# EasyEDA schematic 1-Schematic_TimerAndTemper.json
TITLE: Timer; REV: 1.0; Date: 2021-10-04; Sheet: 1/1; Drawn By: fangxx3863; Company: Myself
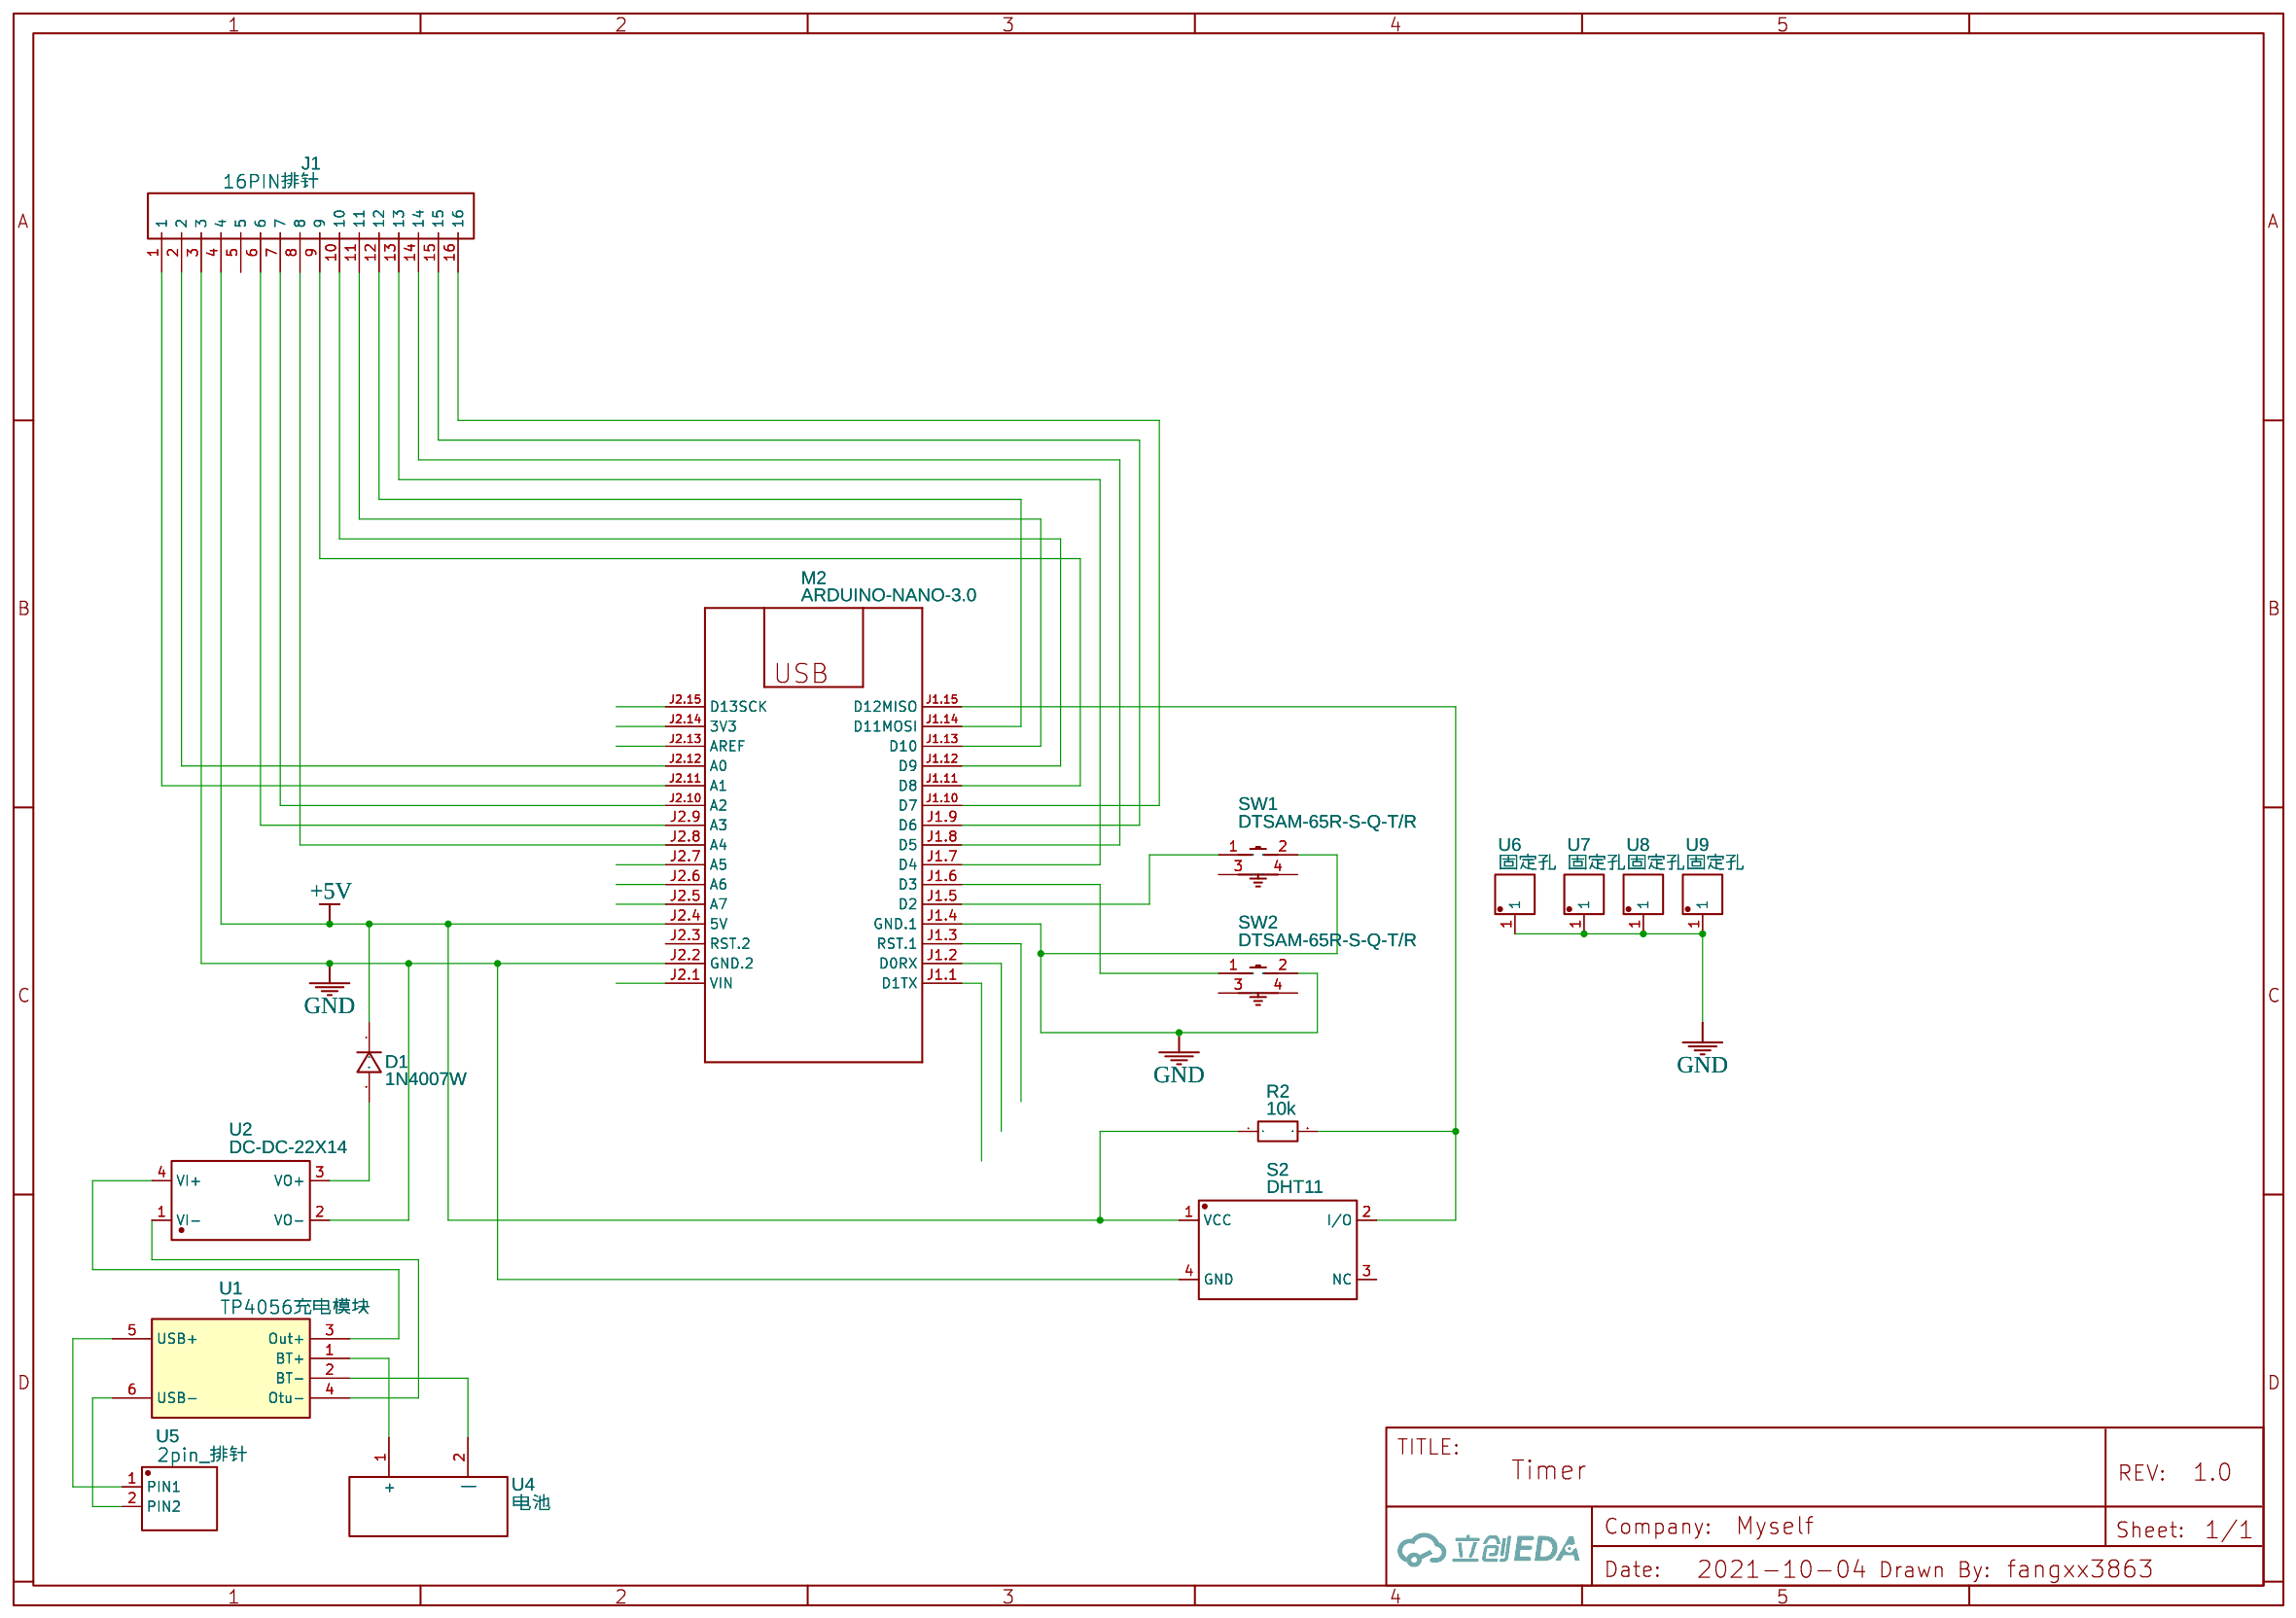
[diagram p0: schematic sheet]

## Parts
D1  1N4007W  [SOD-123_L2.8-W1.8-LS3.7-RD]
J1  16PIN排针  [16PIN排针]
M2  ARDUINO-NANO-3.0  [ARDUINO-NANO-3.0]
R2  10k  [R0603]
S2  DHT11  [DHT11]
SW1  DTSAM-65R-S-Q-T/R  [SW-SMD_DTSAM-65R-S-Q-T-R]
SW2  DTSAM-65R-S-Q-T/R  [SW-SMD_DTSAM-65R-S-Q-T-R]
U1  TP4056充电模块  [TP4056充电模块]
U2  DC-DC-22X14  [DC-DC-22X14]
U4  电池  [电池接口]
U5  2pin_排针  [2PIN 插针]
U6  固定孔  [FIX_HOLE]
U7  固定孔  [FIX_HOLE]
U8  固定孔  [FIX_HOLE]
U9  固定孔  [FIX_HOLE]

## Library data of the parts
D1 = 1N4007W: Supplier: LCSC; Supplier Part: C328592; Manufacturer: BLUE ROCKET; Contributor: LCEDA_Lib
J1 = 16PIN排针: Contributor: MiaoXiangMaker
M2 = ARDUINO-NANO-3.0: Arduino Nano 3.0
R2 = R_0603_EU: Contributor: LCEDA_Lib
S2 = DHT11: Supplier Part: C87032; Supplier: LCSC; Manufacturer: LCSC
SW1 SW2 = DTSAM-65R-S-Q-T/R: Supplier: LCSC; Supplier Part: C501547; Manufacturer: Diptronics; Contributor: LCSC; JLCPCB Part Class: Extended Part
U1 = TP4056充电模块: Contributor: sherlock.min
U2 = DC-DC-22X14: Contributor: lxy21
U4 = 电池: Contributor: WSTRN
U5 = 2pin_排针: Manufacturer Part: 2pin 排针; Contributor: DesignMyself
U6-U9 = 固定孔: Contributor: wanmeng

## Nets
+5V: D1.1 J1.4 M2.J2.4(5V) R2.1 S2.1(VCC)
GND: J1.3 M2.J1.4(GND.1) M2.J2.2(GND.2) S2.4(GND) SW1.2 SW2.2 U2.2(VO-) U6.1 U7.1 U8.1 U9.1
Net-(D1-2): D1.2 U2.3(VO+)
Net-(J1-1): J1.1 M2.J2.11(A1)
Net-(J1-2): J1.2 M2.J2.12(A0)
Net-(J1-6): J1.6 M2.J2.9(A3)
Net-(J1-7): J1.7 M2.J2.10(A2)
Net-(J1-8): J1.8 M2.J2.8(A4)
Net-(J1-9): J1.9 M2.J1.11(D8)
Net-(J1-10): J1.10 M2.J1.12(D9)
Net-(J1-11): J1.11 M2.J1.13(D10)
Net-(J1-12): J1.12 M2.J1.14(D11MOSI)
Net-(J1-13): J1.13 M2.J1.7(D4)
Net-(J1-14): J1.14 M2.J1.8(D5)
Net-(J1-15): J1.15 M2.J1.9(D6)
Net-(J1-16): J1.16 M2.J1.10(D7)
Net-(M2-J1.5): M2.J1.5(D2) SW1.1
Net-(M2-J1.6): M2.J1.6(D3) SW2.1
Net-(M2-J1.15): M2.J1.15(D12MISO) R2.2 S2.2(I/O)
Net-(U1-1): U1.1(BT+) U4.1(+)
Net-(U1-2): U1.2(BT-) U4.2(|)
Net-(U1-3): U1.3(Out+) U2.4(VI+)
Net-(U1-4): U1.4(Otu-) U2.1(VI-)
Net-(U1-5): U1.5(USB+) U5.1(PIN1)
Net-(U1-6): U1.6(USB-) U5.2(PIN2)

Not connected (* = marked no-connect by the designer): J1 5; M2 J1.1(D1TX) J1.2(D0RX) J1.3(RST.1) J2.1(VIN) J2.3(RST.2) J2.5(A7) J2.6(A6) J2.7(A5) J2.13(AREF) J2.14(3V3) J2.15(D13SCK); S2 3(NC); SW1 3 4; SW2 3 4
